# Altium schematic sheet PowerSupply.SchDoc
size A; SheetNumber: 2; SheetTotal: 2
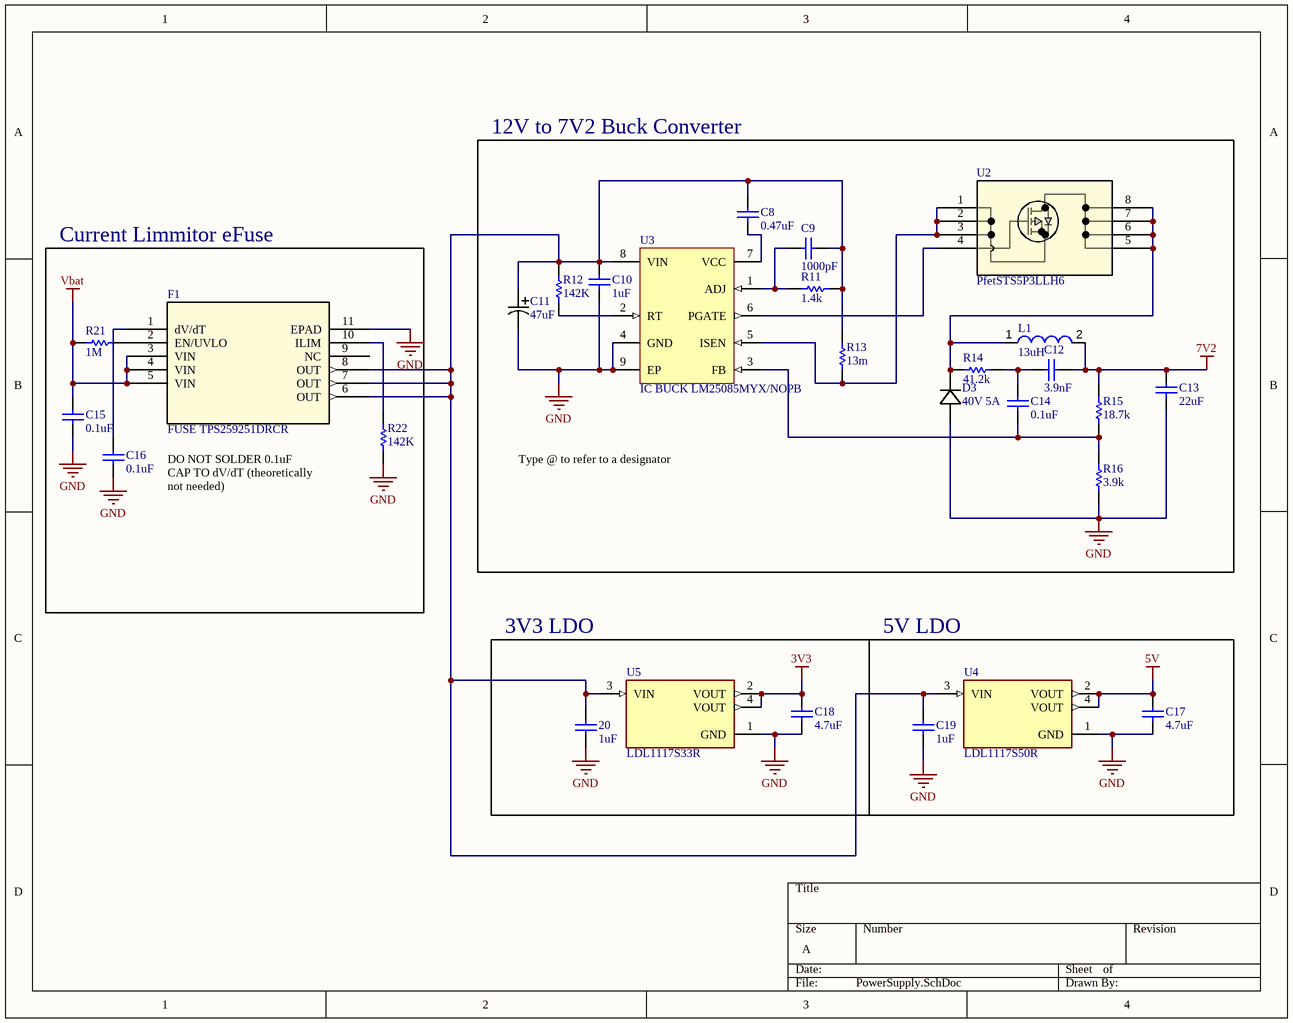
[diagram p0: PowerSupply.SchDoc]

## Parts
20  1uF  [RES 0805]
C8  0.47uF  [RES 0805]
C9  1000pF  [RES 0805]
C10  1uF  [RES 0805]
C11  47uF  [CAP ELC 47uF]
C12  3.9nF  [RES 0805]
C13  22uF  [RES 0805]
C14  0.1uF  [RES 0805]
C15  0.1uF  [RES 0805]
C16  0.1uF  [RES 0805]
C17  4.7uF  [RES 0805]
C18  4.7uF  [RES 0805]
C19  1uF  [RES 0805]
D3  40V 5A  [DIODE SCHOTTKY 40V 5A]
F1  FUSE TPS259251DRCR  [DRC10_1P65X2P40_TEX]
L1  13uH  [IND 13UH 9A 24 MOHM SMD]
R11  1.4k  [RES 0805]
R12  142K  [RES 0805]
R13  13m  [RES 0805]
R14  41.2k  [RES 0805]
R15  18.7k  [RES 0805]
R16  3.9k  [RES 0805]
R21  1M  [RES 0805]
R22  142K  [RES 0805]
U2  PfetSTS5P3LLH6  [STS5P3LLH6]
U3  IC BUCK LM25085MYX/NOPB
U4  LDL1117S50R  [SOT230P700X180-4N]
U5  LDL1117S33R  [SOT230P700X180-4N]

## Blocks framed on the sheet
12V to 7V2 Buck Converter: C8-C14 D3 L1 R11-R16 U2 U3
Current Limmitor eFuse: C15 C16 F1 R21 R22

## Nets
3V3: C18.2 U5.2(VOUT) U5.4(VOUT)
5V: C17.2 U4.2(VOUT) U4.4(VOUT)
7V2: C12.2 C13.2 L1.2 R15.2
GND: 20.1 C10.1 C11.2 C13.1 C15.1 C16.1 C17.1 C18.1 C19.1 D3.2(ANODE) F1.11(EPAD) R16.1 R22.1 U3.4(GND) U3.9(EP) U4.1(GND) U5.1(GND)
Vbat: C15.2 F1.3(VIN) F1.4(VIN) F1.5(VIN) R21.2
Net20_2: 20.2 C8.2 C9.2 C10.2 C11.1 C19.2 F1.6(OUT) F1.7(OUT) F1.8(OUT) R11.2 R12.2 R13.2 U3.8(VIN) U4.3(VIN) U5.3(VIN)
NetC8_1: C8.1 U3.7(VCC)
NetC9_1: C9.1 R11.1 U3.1(ADJ)
NetC12_1: C12.1 C14.2 R14.2
NetC14_1: C14.1 R15.1 R16.2 U3.3(FB)
NetC16_2: C16.2 F1.1(dV/dT)
NetD3_1: D3.1(CATHODE) L1.1 R14.1 U2.5(D) U2.6(D) U2.7(D) U2.8(D)
NetF1_2: F1.2(EN/UVLO) R21.1
NetF1_10: F1.10(ILIM) R22.2
NetR12_1: R12.1 U3.2(RT)
NetR13_1: R13.1 U2.1(S) U2.2(S) U2.3(S) U3.5(ISEN)
NetU2_4: U2.4(G) U3.6(PGATE)

Not connected (* = marked no-connect by the designer): F1 9(NC)

## Notes on the sheet
- DO NOT SOLDER 0.1uF CAP TO dV/dT (theoretically not needed)
- (near D3) Type @ to refer to a designator
- 3V3 LDO
- 5V LDO

## Library data of the parts
20 C10 C19 = CAP CER 1uF 10% 50V 0805: Ceramic Capacitor, Multilayer, Ceramic, 50V, 10% +Tol, 10% -Tol, X7R, 15% TC, 1uF, Surface Mount, 0805; Manufacturer: Samsung; Manufacturer Part Number: CL21B105KBFNNNE; Multilayer: Yes; Supplier: Digikey; Supplier Part Number: 1276-1029-1-ND; RoHS: Yes; Category: Ceramic Capacitors; Stock: 572828; Pricing: 1=0.1, 10=0.051, 100=0.0321, 1000=0.02181 (USD); Mounting Technology: Surface Mount; Pins: 2; Dielectric Material: Ceramic; Package Shape: Rectangular; Case/Package: 0805; Terminal Finish: Nickel; Min Operating Temperature: -55°C; Max Operating Temperature: 125°C; JESD-609 Code: e3; Value: 1uF; Capacitor Type: Ceramic; Tolerance  (fill in as +-): 10%; Package Style: SMTMeter; Packaging: Tape and Reel; Tolerance (fill in as +-): 10%; Rated DC Voltage (URdc): 50V; Temperature Characteristics Code: X7R; Termination: Wraparound; Length: 2mm; Width: 1.25mm; Height: 1.35mm; Reach SVHC Compliant: Yes; RoHS Compliant: Yes; ComponentLink1URL: https://datasheet.ciiva.com:443/pdfs/VipMasterIC/IC/SEMS/SEMS-S-A0008524728/SEMS-S-A0008523023-1.pdf?src-supplier=IHS+Markit; ComponentLink1Description: https://datasheet.ciiva.com:443/pdfs/VipMasterIC/IC/SEMS/SEMS-S-A0008524728/SEMS-S-A0008523023-1.pdf?src-supplier=IHS+Markit; ComponentLink2URL: https://datasheet.ciiva.com/25800/cl21b105kbfnnne-25800291.pdf?src-supplier=Digikey; ComponentLink2Description: https://datasheet.ciiva.com/25800/cl21b105kbfnnne-25800291.pdf?src-supplier=Digikey; ComponentLink3URL: https://datasheet.ciiva.com/16449/cl21b105kbfnnne-16449003.pdf?src-supplier=Future+Electronics; ComponentLink3Description: https://datasheet.ciiva.com/16449/cl21b105kbfnnne-16449003.pdf?src-supplier=Future+Electronics
C8 = CAP CER 0.47uF 10% 50V 0805: Ceramic Capacitor, Multilayer, Ceramic, 50V, 10% +Tol, 10% -Tol, X7R, 15% TC, 0.47uF, Surface Mount, 0805; Manufacturer: Murata; Manufacturer Part Number: GRM21BR71H474KA88L; Value: 470nF; Multilayer: Yes; Supplier: Mouser; Supplier Part Number: 81-GRM21BR71H474KA88; RoHS: Yes; Category: Ceramic Capacitors; Stock: 177825; Pricing: 1=0.19, 10=0.114, 50=0.114, 100=0.08, 1000=0.057, 10000=0.036 (USD); Mounting Technology: Surface Mount; Pins: 2; Dielectric Material: Ceramic; Package Shape: Rectangular; Case/Package: 0805; Terminal Finish: Nickel; Min Operating Temperature: -55°C; Max Operating Temperature: 125°C; JESD-609 Code: e3; Capacitor Type: Ceramic; Tolerance  (fill in as +-): 10%; Package Style: SMTMeter; Packaging: Tape and Reel; Tolerance (fill in as +-): 10%; Rated DC Voltage (URdc): 50V; Temperature Characteristics Code: X7R; Termination: Wraparound; Length: 2mm; Width: 1.25mm; Height: 1.25mm; Reach SVHC Compliant: Yes; RoHS Compliant: Yes; ComponentLink1URL: https://datasheet.ciiva.com:443/pdfs/VipMasterIC/IC/MURE/MURE-S-A0008911154/MURE-S-A0008911261-1.pdf?src-supplier=IHS+Markit; ComponentLink1Description: https://datasheet.ciiva.com:443/pdfs/VipMasterIC/IC/MURE/MURE-S-A0008911154/MURE-S-A0008911261-1.pdf?src-supplier=IHS+Markit; ComponentLink2URL: https://datasheet.ciiva.com/3777/4932grm21br71h474ka8823-3777215.pdf?src-supplier=Arrow+Electronics; ComponentLink2Description: https://datasheet.ciiva.com/3777/4932grm21br71h474ka8823-3777215.pdf?src-supplier=Arrow+Electronics; ComponentLink3URL: https://datasheet.ciiva.com/11789/0900766b80ef921d-11789192.pdf?src-supplier=Rs; ComponentLink3Description: https://datasheet.ciiva.com/11789/0900766b80ef921d-11789192.pdf?src-supplier=Rs; ComponentLink4URL: https://datasheet.ciiva.com/19476/1859010-19476382.pdf?src-supplier=Jameco; ComponentLink4Description: https://datasheet.ciiva.com/19476/1859010-19476382.pdf?src-supplier=Jameco; ComponentLink5URL: https://datasheet.ciiva.com/29200/453181-da-01-en-vs-kondensator-0805-29200574.pdf?src-supplier=Conrad; ComponentLink5Description: https://datasheet.ciiva.com/29200/453181-da-01-en-vs-kondensator-0805-29200574.pdf?src-supplier=Conrad; ComponentLink6URL: https://datasheet.ciiva.com/137/product-137379.pdf?src-supplier=Digikey; ComponentLink6Description: https://datasheet.ciiva.com/137/product-137379.pdf?src-supplier=Digikey; ComponentLink7URL: https://datasheet.ciiva.com/137/product-137380.pdf?src-supplier=Digikey; ComponentLink7Description: https://datasheet.ciiva.com/137/product-137380.pdf?src-supplier=Digikey; ComponentLink8URL: https://datasheet.ciiva.com/137/product-137381.pdf?src-supplier=Digikey; ComponentLink8Description: https://datasheet.ciiva.com/137/product-137381.pdf?src-supplier=Digikey; ComponentLink9URL: https://datasheet.ciiva.com/14116/grm21br71h474ka88l-eng-tds-14116422.pdf?src-supplier=Distrelec; ComponentLink9Description: https://datasheet.ciiva.com/14116/grm21br71h474ka88l-eng-tds-14116422.pdf?src-supplier=Distrelec; ComponentLink10URL: https://datasheet.ciiva.com/16357/product-16357717.pdf?src-supplier=Future+Electronics; ComponentLink10Description: https://datasheet.ciiva.com/16357/product-16357717.pdf?src-supplier=Future+Electronics
C9 = CAP CER 1000pF 10% 50V 0805: Ceramic Capacitor, Multilayer, Ceramic, 50V, 10% +Tol, 10% -Tol, X7R, 15% TC, 0.001uF, Surface Mount, 0805; Manufacturer: KEMET; Manufacturer Part Number: C0805C102K5RACTU; Value: 1nF; Multilayer: Yes; Supplier: Arrow Electronics; Supplier Part Number: C0805C102K5RACTU; RoHS: Yes; Category: Ceramic Capacitors; Stock: 1152000; Pricing: 4000=0.0176, 8000=0.0114 (USD); Mounting Technology: Surface Mount; Pins: 2; Dielectric Material: Ceramic; Package Shape: Rectangular; Case/Package: 0805; Terminal Finish: Nickel; Min Operating Temperature: -55°C; Max Operating Temperature: 125°C; JESD-609 Code: e3; Capacitor Type: Ceramic; Tolerance  (fill in as +-): 10%; Packaging: Tape and Reel; Tolerance (fill in as +-): 10%; Rated DC Voltage (URdc): 50V; Temperature Characteristics Code: X7R; Termination: Wraparound; Reach SVHC Compliant: Yes; RoHS Compliant: Yes; ComponentLink1URL: http://capacitoredge.kemet.com:80/capedge2/intellispec.jsp?pn=C0805C102K5RACTU&displayPN=C0805C102K5RACTU&src-supplier=IHS+Markit; ComponentLink1Description: http://capacitoredge.kemet.com:80/capedge2/intellispec.jsp?pn=C0805C102K5RACTU&displayPN=C0805C102K5RACTU&src-supplier=IHS+Markit; ComponentLink2URL: https://datasheet.ciiva.com/18193/getdatasheetpartid-385640-18193338.pdf?src-supplier=Verical; ComponentLink2Description: https://datasheet.ciiva.com/18193/getdatasheetpartid-385640-18193338.pdf?src-supplier=Verical; ComponentLink3URL: https://datasheet.ciiva.com/7842/1918693-7842527.pdf?src-supplier=Element14; ComponentLink3Description: https://datasheet.ciiva.com/7842/1918693-7842527.pdf?src-supplier=Element14; ComponentLink4URL: https://datasheet.ciiva.com/39122/docfinderpartnumberc0402c102k5ractu-39122922.pdf?src-supplier=Onlinecomponents.com; ComponentLink4Description: https://datasheet.ciiva.com/39122/docfinderpartnumberc0402c102k5ractu-39122922.pdf?src-supplier=Onlinecomponents.com
C11 = CAP ELCALUM 47uF 20% 50V: Aluminum Electrolytic Capacitor, Polarized, Aluminum (wet), 50V, 20% +Tol, 20% -Tol, 47uF, Surface Mount, 2626; Manufacturer: Nichicon; Manufacturer Part Number: UWT1H470MCL1GS; Dielectric Material: Aluminium; Leakage Current: 23.5uA; Ripple Current: 63mA; Tan Delta: 0.14; Supplier: Digikey; Supplier Part Number: 493-2225-1-ND; RoHS: Yes; Category: Aluminum Electrolytic Capacitors; Stock: 52254; Pricing: 1=0.42, 10=0.258, 50=0.1948, 100=0.1747 (USD); Mounting Technology: Surface Mount; Pins: 2; Package Shape: Cylindrical; Case/Package: 2626; Terminal Finish: Tin; Min Operating Temperature: -55°C; Max Operating Temperature: 105°C; JESD-609 Code: e6; Polarity: Polarized; Value: 47uF; Capacitor Type: Aluminium; Tolerance  (fill in as +-): 20%; Package Style: SMTMeter; Packaging: Tape and Reel; Tolerance (fill in as +-): 20%; Rated DC Voltage (URdc): 50V; Termination: One Surface; Length: 7mm; Width: 6.6mm; Height: 7.7mm; Reach SVHC Compliant: No; RoHS Compliant: Yes; ComponentLink1URL: https://datasheet.ciiva.com:443/pdfs/VipMasterIC/IC/NICH/NICH-S-A0009252174/NICH-S-A0009252174-1.pdf?src-supplier=IHS+Markit; ComponentLink1Description: https://datasheet.ciiva.com:443/pdfs/VipMasterIC/IC/NICH/NICH-S-A0009252174/NICH-S-A0009252174-1.pdf?src-supplier=IHS+Markit; ComponentLink2URL: https://datasheet.ciiva.com/11777/0900766b80649b51-11777944.pdf?src-supplier=Rs; ComponentLink2Description: https://datasheet.ciiva.com/11777/0900766b80649b51-11777944.pdf?src-supplier=Rs; ComponentLink3URL: https://datasheet.ciiva.com/30522/getdatasheetpartid-450029-30522236.pdf?src-supplier=Verical; ComponentLink3Description: https://datasheet.ciiva.com/30522/getdatasheetpartid-450029-30522236.pdf?src-supplier=Verical; ComponentLink4URL: https://datasheet.ciiva.com/96/e-wt-96728.pdf?src-supplier=Digikey; ComponentLink4Description: https://datasheet.ciiva.com/96/e-wt-96728.pdf?src-supplier=Digikey; ComponentLink5URL: https://datasheet.ciiva.com/96/e-wt-96729.pdf?src-supplier=Digikey; ComponentLink5Description: https://datasheet.ciiva.com/96/e-wt-96729.pdf?src-supplier=Digikey; ComponentLink6URL: https://datasheet.ciiva.com/96/e-wt-96730.pdf?src-supplier=Digikey; ComponentLink6Description: https://datasheet.ciiva.com/96/e-wt-96730.pdf?src-supplier=Digikey; ComponentLink7URL: https://datasheet.ciiva.com/11687/e-wt-11687610.pdf?src-supplier=Avnet; ComponentLink7Description: https://datasheet.ciiva.com/11687/e-wt-11687610.pdf?src-supplier=Avnet; ComponentLink8URL: https://datasheet.ciiva.com/16512/e-wt-16512663.pdf?src-supplier=Future+Electronics; ComponentLink8Description: https://datasheet.ciiva.com/16512/e-wt-16512663.pdf?src-supplier=Future+Electronics
C12 = CAP CER 3.9nF 10% 50V 0805: Ceramic Capacitor, Multilayer, Ceramic, 50V, 10% +Tol, 10% -Tol, X7R, 15% TC, 0.0039uF, Surface Mount, 0805; Manufacturer: Yageo; Manufacturer Part Number: CC0805KRX7R9BB392; Multilayer: Yes; Supplier: Digikey; Supplier Part Number: 311-1132-1-ND; RoHS: Yes; Category: Ceramic Capacitors; Stock: 12532; Pricing: 1=0.1, 10=0.058, 100=0.0361, 1000=0.02472 (USD); Mounting Technology: Surface Mount; Pins: 2; Dielectric Material: Ceramic; Package Shape: Rectangular; Case/Package: 0805; Terminal Finish: Nickel; Min Operating Temperature: -55°C; Max Operating Temperature: 125°C; JESD-609 Code: e3; Value: 3.9nF; Capacitor Type: Ceramic; Tolerance  (fill in as +-): 10%; Package Style: SMTMeter; Packaging: Tape and Reel; Tolerance (fill in as +-): 10%; Rated DC Voltage (URdc): 50V; Temperature Characteristics Code: X7R; Termination: Wraparound; Length: 2mm; Width: 1.25mm; Height: 0.6mm; Reach SVHC Compliant: Yes; RoHS Compliant: Yes; ComponentLink1URL: https://datasheet.ciiva.com:443/pdfs/VipMasterIC/IC/YAGO/YAGOS02868/YAGOS02868-1.pdf?src-supplier=IHS+Markit; ComponentLink1Description: https://datasheet.ciiva.com:443/pdfs/VipMasterIC/IC/YAGO/YAGOS02868/YAGOS02868-1.pdf?src-supplier=IHS+Markit; ComponentLink2URL: https://datasheet.ciiva.com/144/mlccorderingcode-144622.pdf?src-supplier=Digikey; ComponentLink2Description: https://datasheet.ciiva.com/144/mlccorderingcode-144622.pdf?src-supplier=Digikey; ComponentLink3URL: https://datasheet.ciiva.com/144/mlccorderingcode-144623.pdf?src-supplier=Digikey; ComponentLink3Description: https://datasheet.ciiva.com/144/mlccorderingcode-144623.pdf?src-supplier=Digikey; ComponentLink4URL: https://datasheet.ciiva.com/29148/445107-da-01-en-kerko-chip-0805-x7r-3900pf-10proz-50vg-29148917.pdf?src-supplier=Conrad; ComponentLink4Description: https://datasheet.ciiva.com/29148/445107-da-01-en-kerko-chip-0805-x7r-3900pf-10proz-50vg-29148917.pdf?src-supplier=Conrad; ComponentLink5URL: https://datasheet.ciiva.com/11465/upy-gphc-x7r-6-3v-to-50v-8-11465741.pdf?src-supplier=Avnet; ComponentLink5Description: https://datasheet.ciiva.com/11465/upy-gphc-x7r-6-3v-to-50v-8-11465741.pdf?src-supplier=Avnet; ComponentLink6URL: https://datasheet.ciiva.com/144/mlccorderingcode-144624.pdf?src-supplier=Digikey; ComponentLink6Description: https://datasheet.ciiva.com/144/mlccorderingcode-144624.pdf?src-supplier=Digikey
C13 = CAP CER 22uF 20% 25V 0805: Ceramic Capacitor, Multilayer, Ceramic, 25V, 20% +Tol, 20% -Tol, X5R, 15% TC, 22uF, Surface Mount, 0805; Manufacturer: Samsung; Manufacturer Part Number: CL21A226MAYNNNE; Multilayer: Yes; Supplier: Digikey; Supplier Part Number: 1276-CL21A226MAYNNNECT-ND; RoHS: Yes; Category: Ceramic Capacitors; Stock: 495548; Pricing: 1=0.22, 10=0.13, 100=0.085, 1000=0.06041 (USD); Mounting Technology: Surface Mount; Pins: 2; Dielectric Material: Ceramic; Package Shape: Rectangular; Case/Package: 0805; Min Operating Temperature: -55°C; Max Operating Temperature: 85°C; Value: 22uF; Capacitor Type: Ceramic; Tolerance  (fill in as +-): 20%; Packaging: Tape and Reel; Tolerance (fill in as +-): 20%; Rated DC Voltage (URdc): 25V; Temperature Characteristics Code: X5R; Termination: Wraparound; Reach SVHC Compliant: Yes; RoHS Compliant: Yes; ComponentLink1URL: https://datasheet.ciiva.com:443/pdfs/VipMasterIC/IC/SEMS/SEMS-S-A0008528919/SEMS-S-A0008528829-1.pdf?src-supplier=IHS+Markit; ComponentLink1Description: https://datasheet.ciiva.com:443/pdfs/VipMasterIC/IC/SEMS/SEMS-S-A0008528919/SEMS-S-A0008528829-1.pdf?src-supplier=IHS+Markit; ComponentLink2URL: https://datasheet.octopart.com/CL21A226MAYNNNE-Samsung-Electro-Mechanics-datasheet-149154243.pdf?src-supplier=Future+Electronics; ComponentLink2Description: https://datasheet.octopart.com/CL21A226MAYNNNE-Samsung-Electro-Mechanics-datasheet-149154243.pdf?src-supplier=Future+Electronics; ComponentLink3URL: https://datasheet.octopart.com/CL21A226MAYNNNE-Samsung-datasheet-8326407.pdf?src-supplier=TME; ComponentLink3Description: https://datasheet.octopart.com/CL21A226MAYNNNE-Samsung-datasheet-8326407.pdf?src-supplier=TME
C14-C16 = CAP CER 0.1uF 10% 50V 0805: Ceramic Capacitor, Multilayer, Ceramic, 50V, 10% +Tol, 10% -Tol, X7R, 15% TC, 0.1uF, Surface Mount, 0805; Manufacturer: Yageo; Manufacturer Part Number: CC0805KRX7R9BB104; Value: 100nF; Multilayer: Yes; Supplier: Digikey; Supplier Part Number: 311-1140-1-ND; RoHS: Yes; Category: Ceramic Capacitors; Stock: 3691132; Pricing: 1=0.08, 10=0.021, 100=0.0152, 1000=0.0144, 4000=0.0112, 8000=0.0104, 12000=0.01, 20000=0.00985 (USD); Mounting Technology: Surface Mount; Pins: 2; Dielectric Material: Ceramic; Package Shape: Rectangular; Case/Package: 0805; Terminal Finish: Nickel; Min Operating Temperature: -55°C; Max Operating Temperature: 125°C; JESD-609 Code: e3; Capacitor Type: Ceramic; Tolerance  (fill in as +-): 10%; Package Style: SMTMeter; Packaging: Tape and Reel; Tolerance (fill in as +-): 10%; Rated DC Voltage (URdc): 50V; Temperature Characteristics Code: X7R; Termination: Wraparound; Length: 2mm; Width: 1.25mm; Height: 0.85mm; Reach SVHC Compliant: Yes; RoHS Compliant: Yes; ComponentLink1URL: https://datasheet.ciiva.com:443/pdfs/VipMasterIC/IC/YAGO/YAGO-S-A0003557223/YAGO-S-A0003557223-1.pdf?src-supplier=IHS+Markit; ComponentLink1Description: https://datasheet.ciiva.com:443/pdfs/VipMasterIC/IC/YAGO/YAGO-S-A0003557223/YAGO-S-A0003557223-1.pdf?src-supplier=IHS+Markit; ComponentLink2URL: https://datasheet.ciiva.com/11786/0900766b80d84f1d-11786009.pdf?src-supplier=Rs; ComponentLink2Description: https://datasheet.ciiva.com/11786/0900766b80d84f1d-11786009.pdf?src-supplier=Rs; ComponentLink3URL: https://datasheet.ciiva.com/155/mlccorderingcode-155929.pdf?src-supplier=Digikey; ComponentLink3Description: https://datasheet.ciiva.com/155/mlccorderingcode-155929.pdf?src-supplier=Digikey; ComponentLink4URL: https://datasheet.ciiva.com/155/mlccorderingcode-155930.pdf?src-supplier=Digikey; ComponentLink4Description: https://datasheet.ciiva.com/155/mlccorderingcode-155930.pdf?src-supplier=Digikey; ComponentLink5URL: https://datasheet.ciiva.com/155/mlccorderingcode-155931.pdf?src-supplier=Digikey; ComponentLink5Description: https://datasheet.ciiva.com/155/mlccorderingcode-155931.pdf?src-supplier=Digikey; ComponentLink6URL: https://datasheet.ciiva.com/46393/1734573-46393307.pdf?src-supplier=Element14; ComponentLink6Description: https://datasheet.ciiva.com/46393/1734573-46393307.pdf?src-supplier=Element14; ComponentLink7URL: https://datasheet.ciiva.com/28450/1489800-28450805.pdf?src-supplier=Element14; ComponentLink7Description: https://datasheet.ciiva.com/28450/1489800-28450805.pdf?src-supplier=Element14; ComponentLink8URL: https://datasheet.ciiva.com/11464/upy-gphc-x7r-6-3v-to-50v-8-11464757.pdf?src-supplier=Avnet; ComponentLink8Description: https://datasheet.ciiva.com/11464/upy-gphc-x7r-6-3v-to-50v-8-11464757.pdf?src-supplier=Avnet; ComponentLink9URL: https://datasheet.ciiva.com/29242/445210-da-01-en-kerko-chip-0805-x7r-0-1uf-10proz-50vg-29242074.pdf?src-supplier=Conrad; ComponentLink9Description: https://datasheet.ciiva.com/29242/445210-da-01-en-kerko-chip-0805-x7r-0-1uf-10proz-50vg-29242074.pdf?src-supplier=Conrad
C17 C18 = CAP CER 4.7uF 10% 25V 0805: Ceramic Capacitor, Multilayer, Ceramic, 25V, 10% +Tol, 10% -Tol, X5R, 15% TC, 4.7uF, Surface Mount, 0805; Manufacturer: Samsung; Manufacturer Part Number: CL21A475KAQNNNE; Multilayer: Yes; ComponentLink1Description: https://www.digikey.ca/en/products/detail/samsung-electro-mechanics/CL21A475KAQNNNE/3886902; ComponentLink1URL: *; Supplier: Digikey; Supplier Part Number: 1276-1244-1-ND; RoHS: Yes; Category: Ceramic Capacitors; Stock: 2691488; Pricing: 1=0.1, 10=0.048, 100=0.03, 1000=0.02035 (USD); Mounting Technology: Surface Mount; Pins: 2; Dielectric Material: Ceramic; Package Shape: Rectangular; Case/Package: 0805; Terminal Finish: Nickel; Min Operating Temperature: -55°C; Max Operating Temperature: 85°C; JESD-609 Code: e3; Value: 4.7uF; Capacitor Type: Ceramic; Tolerance  (fill in as +-): 10%; Package Style: SMTMeter; Packaging: Tape and Reel; Tolerance (fill in as +-): 10%; Rated DC Voltage (URdc): 25V; Temperature Characteristics Code: X5R; Termination: Wraparound; Length: 2mm; Width: 1.25mm; Height: 1.4mm; Reach SVHC Compliant: Yes; RoHS Compliant: Yes; ComponentLink2URL: https://datasheet.ciiva.com:443/pdfs/VipMasterIC/IC/SEMS/SEMS-S-A0008528919/SEMS-S-A0008528938-1.pdf?src-supplier=IHS+Markit; ComponentLink2Description: https://datasheet.ciiva.com:443/pdfs/VipMasterIC/IC/SEMS/SEMS-S-A0008528919/SEMS-S-A0008528938-1.pdf?src-supplier=IHS+Markit; ComponentLink3URL: https://datasheet.ciiva.com/25798/cl21a475kaqnnne-25798882.pdf?src-supplier=Digikey; ComponentLink3Description: https://datasheet.ciiva.com/25798/cl21a475kaqnnne-25798882.pdf?src-supplier=Digikey
D3 = DIODE SCHOTTKY 40V 5A: Rectifier Diode, Schottky, 1 Phase, 1 Element, 5A, 40V V(RRM), Silicon, DO-214AC; Manufacturer: MCC; Manufacturer Part Number: SK54A-LTP; Package Body Material: Plastic; Application(s): GENERAL PURPOSE; Forward Voltage: 550mV; Non-rep Pk Forward Current-Max: 100A; Number of Elements: 1; Max Reverse Current: 1mA; Time @ Peak Reflow Temperature-Max (s): 10s; Supplier: Digikey; Supplier Part Number: SK54A-LTPMSCT-ND; RoHS: Yes; Category: Rectifier Diodes; Stock: 28291; Pricing: 1=0.33, 10=0.243, 100=0.1933, 500=0.14502, 1000=0.10466, 2000=0.10359 (USD); Pins: 2; Diode Element Material: SILICON; Package Shape: Rectangular; Min Operating Temperature: -55°C; Max Operating Temperature: 150°C; Diode Type: RECTIFIER; JESD-30 Code: R-PDSO-C2; Moisture Sensitivity Level: 1; Number of Phases: 1; Max Output current: 5A; Package Style: SMALL OUTLINEMeter; Peak Reflow Temperature (Cel): 260°C; Rep Pk Reverse Voltage-Max: 40V; Surface Mount: Yes; Technology: SCHOTTKY; Terminal Form: C BEND; Terminal Position: DUAL; JEDEC-95 Code: DO-214AC; Reach SVHC Compliant: No; RoHS Compliant: Yes; ComponentLink1URL: https://datasheet.ciiva.com:443/pdfs/VipMasterIC/IC/MCCC/MCCC-S-A0009699019/MCCC-S-A0009699019-1.pdf?src-supplier=IHS+Markit; ComponentLink1Description: https://datasheet.ciiva.com:443/pdfs/VipMasterIC/IC/MCCC/MCCC-S-A0009699019/MCCC-S-A0009699019-1.pdf?src-supplier=IHS+Markit; ComponentLink2URL: http://www.mccsemi.com/up_pdf/SK52A-L-SK510A-L(DO-214AC).pdf?src-supplier=Digikey; ComponentLink2Description: http://www.mccsemi.com/up_pdf/SK52A-L-SK510A-L(DO-214AC).pdf?src-supplier=Digikey; ComponentLink3URL: https://datasheet.octopart.com/SK54A-LTP-Micro-Commercial-datasheet-137977739.pdf?src-supplier=Future+Electronics; ComponentLink3Description: https://datasheet.octopart.com/SK54A-LTP-Micro-Commercial-datasheet-137977739.pdf?src-supplier=Future+Electronics
F1 = FUSE TPS259251DRCR: Power Supply Support Circuit, Adjustable, 1 Channel, PDSO10; Manufacturer: Texas Instruments; Package Body Material: Plastic; Adjustable Threshold: Yes; Number of Channels: 1; Max Supply Voltage: 5.5V; Min Supply Voltage: 4.5V; Nominal Supply Voltage: 5V; Supplier: Digikey; Supplier Part Number: 296-47233-1-ND; Manufacturer Part Number: TPS259251DRCR; RoHS: Yes; Category: Integrated Circuits (ICs); Stock: 4315; Pricing: 1=1.39, 10=1.09, 100=0.767, 500=0.624, 1000=0.577 (USD); Case/Package: HVSON; Pins: 10; Package Shape: Square; Terminal Finish: Nickel; Min Operating Temperature: -40°C; Max Operating Temperature: 85°C; JESD-609 Code: e4; Throw Configuration: POWER SUPPLY SUPPORT CIRCUIT; JESD-30 Code: S-PDSO-N10; Moisture Sensitivity Level: 2; Channels: 1; Package Style: SMALL OUTLINE, HEAT SINK/SLUG, VERY THIN PROFILEMeter; Surface Mount: Yes; Terminal Form: No Lead; Terminal Position: DUAL; Length: 3mm; Width: 3mm; Height - Seated (Max): 1mm; Terminal Pitch: 0.5mm; Temperature Grade: INDUSTRIAL; Reach SVHC Compliant: Yes; RoHS Compliant: Yes; ComponentLink1URL: https://www.ti.com:443/lit/ds/symlink/tps25925.pdf?src-supplier=IHS+Markit; ComponentLink1Description: https://www.ti.com:443/lit/ds/symlink/tps25925.pdf?src-supplier=IHS+Markit; ComponentLink2URL: http://www.ti.com/lit/ds/symlink/tps25925.pdf?src-supplier=Digikey; ComponentLink2Description: http://www.ti.com/lit/ds/symlink/tps25925.pdf?src-supplier=Digikey; ComponentLink3URL: http://www.ti.com/general/docs/suppproductinfo.tsp?distId=10&amp;gotoUrl=http%3A%2F%2Fwww.ti.com%2Flit%2Fgpn%2Ftps25925&src-supplier=Digikey; ComponentLink3Description: http://www.ti.com/general/docs/suppproductinfo.tsp?distId=10&amp;gotoUrl=http%3A%2F%2Fwww.ti.com%2Flit%2Fgpn%2Ftps25925&src-supplier=Digikey; ComponentLink4URL: http://www.ti.com/general/docs/lit/getliterature.tsp?genericPartNumber=TPS25925&&fileType=pdf&src-supplier=Avnet; ComponentLink4Description: http://www.ti.com/general/docs/lit/getliterature.tsp?genericPartNumber=TPS25925&&fileType=pdf&src-supplier=Avnet; ComponentLink5URL: http://www.ti.com/lit/gpn/tps25925?src-supplier=Mouser; ComponentLink5Description: http://www.ti.com/lit/gpn/tps25925?src-supplier=Mouser
L1 = IND 13uH 9A: General Purpose Inductor, 13uH, 20%, 1 Element, SMD, 5550; Manufacturer: Pulse; Manufacturer Part Number: PA4343.133NLT; Supplier: Digikey; Supplier Part Number: 553-3445-1-ND; RoHS: Yes; Category: Fixed Inductors; Stock: 3011; Pricing: 1=1.77, 10=1.377, 25=1.2456, 50=1.1542, 100=1.0692, 250=0.96604 (USD); Inductor Type: GENERAL PURPOSE INDUCTOR; Reach SVHC Compliant: Yes; RoHS Compliant: Yes; ComponentLink1URL: https://datasheet.ciiva.com:443/pdfs/VipMasterIC/IC/PLEI/PLEI-S-A0006344815/PLEI-S-A0006344815-1.pdf?src-supplier=IHS+Markit; ComponentLink1Description: https://datasheet.ciiva.com:443/pdfs/VipMasterIC/IC/PLEI/PLEI-S-A0006344815/PLEI-S-A0006344815-1.pdf?src-supplier=IHS+Markit; ComponentLink2URL: https://datasheet.octopart.com/PA4343.133NLT-Pulse-datasheet-137333301.pdf?src-supplier=Sager+Electronics; ComponentLink2Description: https://datasheet.octopart.com/PA4343.133NLT-Pulse-datasheet-137333301.pdf?src-supplier=Sager+Electronics; ComponentLink3URL: https://datasheet.octopart.com/PA4343.133NLT-Pulse-datasheet-165531498.pdf?src-supplier=Master+Electronics; ComponentLink3Description: https://datasheet.octopart.com/PA4343.133NLT-Pulse-datasheet-165531498.pdf?src-supplier=Master+Electronics
R11 = RES 1.4k 1% 0.125W 0805: Fixed Resistor, Metal Glaze/thick Film, 0.125W, 1400ohm, 150V, 1% +/-Tol, 100ppm/Cel, Surface Mount, 0805; Manufacturer: Yageo; Manufacturer Part Number: RC0805FR-071K4L; Additional Feature: LASER TRIMMABLE; Power: 125mW; Rated Temperature: 70°C; Value: 1.4kR; Temperature Coefficient (ppm/Cel): 100; Package Height: 0.5mm; Package Length: 2mm; Package Width: 1.25mm; Supplier: Future Electronics; Supplier Part Number: 5205166; RoHS: Yes; Category: Chip SMD Resistors; Stock: 70000; Pricing: 5000=0.0021, 20000=0.002, 100000=0.0019, 200000=0.0018, 625000=0.0017 (USD); Mounting Technology: Surface Mount; Pins: 2; Package Shape: Rectangular; Case/Package: 0805; Terminal Finish: Nickel; Min Operating Temperature: -55°C; Max Operating Temperature: 155°C; Tolerance: 1%; JESD-609 Code: e3; Resistor Type: FIXED RESISTOR; Construction: Chip; Packaging: Tape and Reel; Technology: METAL GLAZE/THICK FILM; Termination: Wraparound; Working Voltage: 150V; Reach SVHC Compliant: Yes; RoHS Compliant: Yes; ComponentLink1URL: https://datasheet.ciiva.com:443/pdfs/VipMasterIC/IC/YAGO/YAGO-S-A0008145938/YAGO-S-A0008145938-1.pdf?src-supplier=IHS+Markit; ComponentLink1Description: https://datasheet.ciiva.com:443/pdfs/VipMasterIC/IC/YAGO/YAGO-S-A0008145938/YAGO-S-A0008145938-1.pdf?src-supplier=IHS+Markit; ComponentLink2URL: https://datasheet.ciiva.com/2519/pyu-r-int-thick-7-2519780.pdf?src-supplier=Digikey; ComponentLink2Description: https://datasheet.ciiva.com/2519/pyu-r-int-thick-7-2519780.pdf?src-supplier=Digikey; ComponentLink3URL: https://datasheet.ciiva.com/2519/pyu-r-int-thick-7-2519781.pdf?src-supplier=Digikey; ComponentLink3Description: https://datasheet.ciiva.com/2519/pyu-r-int-thick-7-2519781.pdf?src-supplier=Digikey; ComponentLink4URL: https://datasheet.ciiva.com/2519/pyu-r-int-thick-7-2519782.pdf?src-supplier=Digikey; ComponentLink4Description: https://datasheet.ciiva.com/2519/pyu-r-int-thick-7-2519782.pdf?src-supplier=Digikey; ComponentLink5URL: https://datasheet.ciiva.com/5596/rc0805-5596057.pdf?src-supplier=Mouser; ComponentLink5Description: https://datasheet.ciiva.com/5596/rc0805-5596057.pdf?src-supplier=Mouser; ComponentLink6URL: https://datasheet.ciiva.com/17033/rc0805-17033654.pdf?src-supplier=Future+Electronics; ComponentLink6Description: https://datasheet.ciiva.com/17033/rc0805-17033654.pdf?src-supplier=Future+Electronics
R12 R22 = RES 142K 0.1% 1/8W 0805: Fixed Resistor, Thin Film, 0.125W, 142000ohm, 150V, 0.1% +/-Tol, 25ppm/Cel, Surface Mount, 0805; Manufacturer: Yageo; Manufacturer Part Number: RT0805BRD07142KL; Manufacturer Series: RT; Power: 125mW; Rated Temperature: 70°C; Value: 142kR; Temperature Coefficient (ppm/Cel): 25; Package Height: 0.5mm; Package Length: 2mm; Package Width: 1.25mm; Supplier: Digikey; Supplier Part Number: 13-RT0805BRD07142KLCT-ND; RoHS: Yes; Category: Chip SMD Resistors; Stock: 9837; Pricing: 1=0.17, 10=0.122, 50=0.0958, 100=0.086, 500=0.06622, 1000=0.05881 (USD); Mounting Technology: Surface Mount; Pins: 2; Package Shape: Rectangular; Case/Package: 0805; Terminal Finish: Nickel; Min Operating Temperature: -55°C; Max Operating Temperature: 155°C; Tolerance: 0.1%; JESD-609 Code: e3; Resistor Type: FIXED RESISTOR; Construction: Chip; Packaging: Tape and Reel; Series: RT; Technology: THIN FILM; Termination: Wraparound; Working Voltage: 150V; Reach SVHC Compliant: Yes; RoHS Compliant: Yes; ComponentLink1URL: https://datasheet.ciiva.com:443/pdfs/VipMasterIC/IC/YAGO/YAGOS01974/YAGOS01974-1.pdf?src-supplier=IHS+Markit; ComponentLink1Description: https://datasheet.ciiva.com:443/pdfs/VipMasterIC/IC/YAGO/YAGOS01974/YAGOS01974-1.pdf?src-supplier=IHS+Markit; ComponentLink2URL: https://www.yageo.com/upload/media/product/productsearch/datasheet/rchip/PYu-RT_1-to-0.01_RoHS_L_12.pdf?src-supplier=Digikey; ComponentLink2Description: https://www.yageo.com/upload/media/product/productsearch/datasheet/rchip/PYu-RT_1-to-0.01_RoHS_L_12.pdf?src-supplier=Digikey
R13 = RES 13m 0.5% 0.5W 0805: Resistor Thick Film 0.013Ohm 0.5% 0.5W 2-Pin 0805 T/R; Manufacturer: Panasonic; Manufacturer Part Number: ERJ-6CWDR013V; Supplier: Mouser; Supplier Part Number: 667-ERJ-6CWDR013V; RoHS: No; Category: Chip SMD Resistors; Stock: 7014; Pricing: 1=0.6, 10=0.275, 50=0.275, 100=0.219, 1000=0.149, 10000=0.128 (USD); ComponentLink1URL: https://industrial.panasonic.com/cdbs/www-data/pdf/RDN0000/AOA0000C313.pdf?src-supplier=Digikey; ComponentLink1Description: https://industrial.panasonic.com/cdbs/www-data/pdf/RDN0000/AOA0000C313.pdf?src-supplier=Digikey; ComponentLink2URL: https://datasheet.octopart.com/ERJ-6CWDR013V-Panasonic-datasheet-136473239.pdf?src-supplier=Electro+Sonic; ComponentLink2Description: https://datasheet.octopart.com/ERJ-6CWDR013V-Panasonic-datasheet-136473239.pdf?src-supplier=Electro+Sonic
R14 = RES 41.2K 1% 0.125W 0805: Fixed Resistor, Metal Glaze/thick Film, 0.125W, 41200ohm, 150V, 1% +/-Tol, 100ppm/Cel, Surface Mount, 0805; Manufacturer: Vishay; Manufacturer Part Number: CRCW080541K2FKEA; Power: 125mW; Value: 41.2kR; Temperature Coefficient (ppm/Cel): 100; Rated Temperature: 70°C; Package Height: 0.45mm; Package Length: 2mm; Package Width: 1.25mm; Reference Standard: AEC-Q200; Supplier: Arrow Electronics; Supplier Part Number: CRCW080541K2FKEA; RoHS: Yes; Category: Chip SMD Resistors; Stock: 1; Pricing: 1=0.0041 (USD); Mounting Technology: Surface Mount; Pins: 2; Case/Package: 0805; Terminal Finish: Nickel; Package Shape: Rectangular; Min Operating Temperature: -55°C; Max Operating Temperature: 155°C; Tolerance: 1%; JESD-609 Code: e3; Resistor Type: FIXED RESISTOR; Construction: Chip; Packaging: Tape and Reel; Technology: METAL GLAZE/THICK FILM; Working Voltage: 150V; Termination: Wraparound; Reach SVHC Compliant: Yes; RoHS Compliant: Yes; ComponentLink1URL: https://datasheet.ciiva.com:443/pdfs/VipMasterIC/IC/VISH/VISH-S-A0007266705/VISH-S-A0007266705-1.pdf?src-supplier=IHS+Markit; ComponentLink1Description: https://datasheet.ciiva.com:443/pdfs/VipMasterIC/IC/VISH/VISH-S-A0007266705/VISH-S-A0007266705-1.pdf?src-supplier=IHS+Markit; ComponentLink2URL: https://datasheet.ciiva.com/2467/dcrcwe3-2467875.pdf?src-supplier=Digikey; ComponentLink2Description: https://datasheet.ciiva.com/2467/dcrcwe3-2467875.pdf?src-supplier=Digikey; ComponentLink3URL: https://datasheet.ciiva.com/2467/dcrcwe3-2467876.pdf?src-supplier=Digikey; ComponentLink3Description: https://datasheet.ciiva.com/2467/dcrcwe3-2467876.pdf?src-supplier=Digikey; ComponentLink4URL: https://datasheet.ciiva.com/2467/dcrcwe3-2467877.pdf?src-supplier=Digikey; ComponentLink4Description: https://datasheet.ciiva.com/2467/dcrcwe3-2467877.pdf?src-supplier=Digikey; ComponentLink5URL: https://datasheet.ciiva.com/9009/dcrcwe3-9009672.pdf?src-supplier=Avnet; ComponentLink5Description: https://datasheet.ciiva.com/9009/dcrcwe3-9009672.pdf?src-supplier=Avnet; ComponentLink6URL: https://datasheet.ciiva.com/5552/dcrcwe3-109170-5552669.pdf?src-supplier=Mouser; ComponentLink6Description: https://datasheet.ciiva.com/5552/dcrcwe3-109170-5552669.pdf?src-supplier=Mouser; ComponentLink7URL: https://datasheet.ciiva.com/7671/1697337-7671701.pdf?src-supplier=Element14; ComponentLink7Description: https://datasheet.ciiva.com/7671/1697337-7671701.pdf?src-supplier=Element14; ComponentLink8URL: https://datasheet.ciiva.com/7725/125364-7725967.pdf?src-supplier=Element14; ComponentLink8Description: https://datasheet.ciiva.com/7725/125364-7725967.pdf?src-supplier=Element14; ComponentLink9URL: https://datasheet.ciiva.com/22702/1697337-22702910.pdf?src-supplier=Element14; ComponentLink9Description: https://datasheet.ciiva.com/22702/1697337-22702910.pdf?src-supplier=Element14; ComponentLink10URL: https://datasheet.ciiva.com/16200/dcrcwe3-16200485.pdf?src-supplier=Future+Electronics; ComponentLink10Description: https://datasheet.ciiva.com/16200/dcrcwe3-16200485.pdf?src-supplier=Future+Electronics
R15 = RES 18.7k 1% 0.125W 0805: Fixed Resistor, Metal Glaze/thick Film, 0.125W, 18700ohm, 150V, 1% +/-Tol, 100ppm/Cel, Surface Mount, 0805; Manufacturer: Stackpole Electronics; Manufacturer Part Number: RMCF0805FT18K7; Power: 125mW; Rated Temperature: 70°C; Value: 18.7kR; Temperature Coefficient (ppm/Cel): 100; Package Height: 0.5mm; Package Length: 2mm; Package Width: 1.25mm; Reference Standard: AEC-Q200; Supplier: Digikey; Supplier Part Number: RMCF0805FT18K7CT-ND; RoHS: Yes; Category: Chip SMD Resistors; Stock: 214137; Pricing: 1=0.1, 10=0.025, 100=0.012, 1000=0.00628, 2500=0.00538 (USD); Mounting Technology: Surface Mount; Pins: 2; Package Shape: Rectangular; Case/Package: 0805; Terminal Finish: Nickel; Min Operating Temperature: -55°C; Max Operating Temperature: 155°C; Tolerance: 1%; JESD-609 Code: e3; Resistor Type: FIXED RESISTOR; Construction: Rectangular; Packaging: Tape and Reel; Technology: METAL GLAZE/THICK FILM; Termination: Wraparound; Working Voltage: 150V; Reach SVHC Compliant: Yes; RoHS Compliant: Yes; ComponentLink1URL: https://datasheet.ciiva.com:443/pdfs/VipMasterIC/IC/SEIE/SEIE-S-A0009541969/SEIE-S-A0009541969-1.pdf?src-supplier=IHS+Markit; ComponentLink1Description: https://datasheet.ciiva.com:443/pdfs/VipMasterIC/IC/SEIE/SEIE-S-A0009541969/SEIE-S-A0009541969-1.pdf?src-supplier=IHS+Markit; ComponentLink2URL: http://components.arrow.com/part/dataview/50586056S357577N1174?src-supplier=Arrow+Electronics; ComponentLink2Description: http://components.arrow.com/part/dataview/50586056S357577N1174?src-supplier=Arrow+Electronics; ComponentLink3URL: https://www.seielect.com/catalog/sei-rmcf_rmcp.pdf?src-supplier=Digikey; ComponentLink3Description: https://www.seielect.com/catalog/sei-rmcf_rmcp.pdf?src-supplier=Digikey; ComponentLink4URL: https://www.seielect.com/catalog/SEI-RMCF_RMCP.pdf?src-supplier=Avnet; ComponentLink4Description: https://www.seielect.com/catalog/SEI-RMCF_RMCP.pdf?src-supplier=Avnet; ComponentLink5URL: https://datasheet.octopart.com/RMCF0805FT18K7-Stackpole-Electronics-datasheet-28504820.pdf?src-supplier=Future+Electronics; ComponentLink5Description: https://datasheet.octopart.com/RMCF0805FT18K7-Stackpole-Electronics-datasheet-28504820.pdf?src-supplier=Future+Electronics
R16 = RES 3.9k 1% 0.125W 0805: Fixed Resistor, Metal Glaze/thick Film, 0.125W, 3920ohm, 150V, 1% +/-Tol, 100ppm/Cel, Surface Mount, 0805; Manufacturer: Stackpole Electronics; Manufacturer Part Number: RMCF0805FT3K92; Power: 125mW; Rated Temperature: 70°C; Value: 3.92kR; Temperature Coefficient (ppm/Cel): 100; Package Height: 0.5mm; Package Length: 2mm; Package Width: 1.25mm; Reference Standard: AEC-Q200; Supplier: Digikey; Supplier Part Number: RMCF0805FT3K92CT-ND; RoHS: Yes; Category: Chip SMD Resistors; Stock: 141516; Pricing: 1=0.1, 10=0.021, 50=0.0128, 100=0.0105, 500=0.00704, 1000=0.00602 (USD); Mounting Technology: Surface Mount; Pins: 2; Package Shape: Rectangular; Case/Package: 0805; Terminal Finish: Nickel; Min Operating Temperature: -55°C; Max Operating Temperature: 155°C; Tolerance: 1%; JESD-609 Code: e3; Resistor Type: FIXED RESISTOR; Construction: Rectangular; Packaging: Tape and Reel; Technology: METAL GLAZE/THICK FILM; Termination: Wraparound; Working Voltage: 150V; Reach SVHC Compliant: Yes; RoHS Compliant: Yes; ComponentLink1URL: https://datasheet.ciiva.com:443/pdfs/VipMasterIC/IC/SEIE/SEIE-S-A0009541969/SEIE-S-A0009541969-1.pdf?src-supplier=IHS+Markit; ComponentLink1Description: https://datasheet.ciiva.com:443/pdfs/VipMasterIC/IC/SEIE/SEIE-S-A0009541969/SEIE-S-A0009541969-1.pdf?src-supplier=IHS+Markit; ComponentLink2URL: https://datasheet.ciiva.com/3882/40960751s7172021n1174-3882844.pdf?src-supplier=Arrow+Electronics; ComponentLink2Description: https://datasheet.ciiva.com/3882/40960751s7172021n1174-3882844.pdf?src-supplier=Arrow+Electronics; ComponentLink3URL: https://datasheet.ciiva.com/15193/getdatasheetpartid-565526-15193591.pdf?src-supplier=Verical; ComponentLink3Description: https://datasheet.ciiva.com/15193/getdatasheetpartid-565526-15193591.pdf?src-supplier=Verical
R21 = RES 1M 0.1% 0.26W 0805: Fixed Resistor, Thin Film, 0.125W, 1000000ohm, 150V, 0.1% +/-Tol, 10ppm/Cel, Surface Mount, 0805; Manufacturer: Vishay Dale; Manufacturer Part Number: TNPW08051M00BYEA; Power: 125mW; Rated Temperature: 70°C; Value: 1MR; Temperature Coefficient (ppm/Cel): 10; Package Height: 0.45mm; Package Length: 2mm; Package Width: 1.25mm; Reference Standard: AEC-Q200; Supplier: Digikey; Supplier Part Number: 541-TNPW08051M00BYEACT-ND; RoHS: Yes; Category: Chip SMD Resistors; Stock: 10004; Pricing: 1=0.8, 10=0.665, 50=0.5832, 100=0.552, 500=0.41224, 1000=0.37822 (USD); Mounting Technology: Surface Mount; Pins: 2; Case/Package: 0805; Terminal Finish: Nickel; Min Operating Temperature: -55°C; Max Operating Temperature: 125°C; Tolerance: 0.1%; Resistor Type: FIXED RESISTOR; Construction: Chip; Packaging: Tape and Reel; Technology: THIN FILM; Termination: Wraparound; Working Voltage: 150V; Reach SVHC Compliant: Yes; RoHS Compliant: Yes; ComponentLink1URL: https://datasheet.ciiva.com:443/pdfs/VipMasterIC/IC/VISH/VISH-S-A0009889625/VISH-S-A0009889625-1.pdf?src-supplier=IHS+Markit; ComponentLink1Description: https://datasheet.ciiva.com:443/pdfs/VipMasterIC/IC/VISH/VISH-S-A0009889625/VISH-S-A0009889625-1.pdf?src-supplier=IHS+Markit; ComponentLink2URL: http://www.vishay.com/docs/28758/tnpw_e3.pdf?src-supplier=Digikey; ComponentLink2Description: http://www.vishay.com/docs/28758/tnpw_e3.pdf?src-supplier=Digikey; ComponentLink3URL: http://www.vishay.com/docs/28758/tnpw_e3.pdf?src-supplier=Avnet; ComponentLink3Description: http://www.vishay.com/docs/28758/tnpw_e3.pdf?src-supplier=Avnet
U2 = PfetSTS5P3LLH6: Power Field-Effect Transistor, 5A I(D), 1-Element, P-Channel, Metal-oxide Semiconductor FET; Manufacturer: STMicroelectronics; Power Dissipation-Max (Abs): 2.7W; Supplier: Arrow Electronics; Supplier Part Number: STS5P3LLH6; Manufacturer Part Number: STS5P3LLH6; RoHS: Yes; Category: MOSFETs; Stock: 10000; Pricing: 2500=0.2573 (USD); Max Operating Temperature: 150°C; Polarity/Channel Type: P-CHANNEL; Drain Current-Max (Abs) (ID): 5A; FET Technology: METAL-OXIDE SEMICONDUCTOR; Surface Mount: Yes; Reach SVHC Compliant: Yes; RoHS Compliant: Yes; ComponentLink1URL: https://datasheet.ciiva.com:443/pdfs/VipMasterIC/IC/SGST/SGST-S-A0000954121/SGST-S-A0000954121-1.pdf?src-supplier=IHS+Markit; ComponentLink1Description: https://datasheet.ciiva.com:443/pdfs/VipMasterIC/IC/SGST/SGST-S-A0000954121/SGST-S-A0000954121-1.pdf?src-supplier=IHS+Markit; ComponentLink2URL: http://www.mouser.com/ds/2/389/sts5p3llh6-956744.pdf?src-supplier=Mouser; ComponentLink2Description: http://www.mouser.com/ds/2/389/sts5p3llh6-956744.pdf?src-supplier=Mouser; ComponentLink3URL: http://www.st.com/content/ccc/resource/technical/document/datasheet/94/9d/bf/38/c5/95/4f/03/DM00084057.pdf/files/DM00084057.pdf/jcr:content/translations/en.DM00084057.pdf?src-supplier=Digikey; ComponentLink3Description: http://www.st.com/content/ccc/resource/technical/document/datasheet/94/9d/bf/38/c5/95/4f/03/DM00084057.pdf/files/DM00084057.pdf/jcr:content/translations/en.DM00084057.pdf?src-supplier=Digikey; ComponentLink4URL: https://datasheet.octopart.com/STS5P3LLH6-STMicroelectronics-datasheet-62337213.pdf?src-supplier=TME; ComponentLink4Description: https://datasheet.octopart.com/STS5P3LLH6-STMicroelectronics-datasheet-62337213.pdf?src-supplier=TME
U3 = IC BUCK LM25085MYX/NOPB: Switching Controller, Voltage-mode, 10A, 1000kHz Switching Freq-Max, PDSO8; Manufacturer: TI National Semiconductor; Package Body Material: Plastic; Max Supply Voltage: 42V; Min Input Voltage: 4.5V; Nominal Supply Voltage: 24V; Channels: 1; Package Equivalence Code: TSSOP8,.19; Frequency: 1MHz; Qualification Status: Not Qualified; Supplier: Digikey; Supplier Part Number: 296-LM25085MYX/NOPBCT-ND; Manufacturer Part Number: LM25085MYX/NOPB; RoHS: Yes; Category: Voltage Regulators - Switching; Stock: 7032; Pricing: 1=1.86, 10=1.37, 25=1.2468, 100=1.1115, 250=1.04696, 500=1.00806, 1000=0.97604 (USD); Case/Package: HTSSOP; Pins: 8; Package Shape: Square; Terminal Finish: Tin; Min Operating Temperature: -40°C; Max Operating Temperature: 125°C; JESD-609 Code: e3; Throw Configuration: SWITCHING CONTROLLER; Control Mode: VOLTAGE-MODE; JESD-30 Code: S-PDSO-G8; Moisture Sensitivity Level: 1; Package Style: SMALL OUTLINE, HEAT SINK/SLUG, THIN PROFILE, SHRINK PITCHMeter; Peak Reflow Temperature (Cel): 260°C; Surface Mount: Yes; Switcher Configuration: BUCK; Terminal Form: Gull Wing; Terminal Position: DUAL; Length: 3mm; Width: 3mm; Height - Seated (Max): 1.09mm; Terminal Pitch: 0.65mm; Temperature Grade: AUTOMOTIVE; Reach SVHC Compliant: Yes; RoHS Compliant: Yes; ComponentLink1URL: https://www.ti.com:443/lit/ds/symlink/lm25085-q1.pdf?src-supplier=IHS+Markit; ComponentLink1Description: https://www.ti.com:443/lit/ds/symlink/lm25085-q1.pdf?src-supplier=IHS+Markit; ComponentLink2URL: https://datasheet.ciiva.com/6594/lm25085-6594878.pdf?src-supplier=Digikey; ComponentLink2Description: https://datasheet.ciiva.com/6594/lm25085-6594878.pdf?src-supplier=Digikey
U4 = LDL1117S50R: Fixed Positive LDO Regulator, 5V, 0.6V Dropout, PDSO4; Manufacturer: STMicroelectronics; Package Body Material: Plastic; Dropout Voltage1-Max: 600mV; Max Supply Voltage: 18V; Min Input Voltage: 6V; Channels: 1; Output Current1-Max: 1.2A; Output Voltage1-Max: 5.15V; Output Voltage1-Min: 4.85V; Regulator Type: FIXED POSITIVE SINGLE OUTPUT LDO REGULATOR; Supplier: Arrow Electronics; Supplier Part Number: LDL1117S50R; Manufacturer Part Number: LDL1117S50R; RoHS: Yes; Category: Voltage Regulators - Linear; Stock: 195470; Pricing: 1=0.4496, 10=0.2819, 25=0.2795, 50=0.2738, 100=0.2253, 250=0.2208, 500=0.2045, 1000=0.1573 (USD); Case/Package: SOP; Pins: 4; Package Shape: Rectangular; JESD-30 Code: R-PDSO-G4; Operating Temperature, TJ-Max: 125°C; Operating Temperature, TJ-Min: -40°C; Output Voltage1-Nom: 5V; Package Style: SMALL OUTLINEMeter; Surface Mount: Yes; Terminal Form: Gull Wing; Terminal Position: DUAL; Length: 6.5mm; Width: 3.5mm; Height - Seated (Max): 1.9mm; Terminal Pitch: 2.3mm; Reach SVHC Compliant: Yes; RoHS Compliant: Yes; ComponentLink1URL: https://datasheet.ciiva.com:443/pdfs/VipMasterIC/IC/SGST/SGST-S-A0010030722/SGST-S-A0010030722-1.pdf?src-supplier=IHS+Markit; ComponentLink1Description: https://datasheet.ciiva.com:443/pdfs/VipMasterIC/IC/SGST/SGST-S-A0010030722/SGST-S-A0010030722-1.pdf?src-supplier=IHS+Markit; ComponentLink2URL: http://www.farnell.com/datasheets/2259188.pdf?src-supplier=Farnell; ComponentLink2Description: http://www.farnell.com/datasheets/2259188.pdf?src-supplier=Farnell; ComponentLink3URL: http://www.st.com/content/ccc/resource/technical/document/datasheet/group3/0e/5a/00/ca/10/1a/4f/a5/DM00366442/files/DM00366442.pdf/jcr:content/translations/en.DM00366442.pdf?src-supplier=Digikey; ComponentLink3Description: http://www.st.com/content/ccc/resource/technical/document/datasheet/group3/0e/5a/00/ca/10/1a/4f/a5/DM00366442/files/DM00366442.pdf/jcr:content/translations/en.DM00366442.pdf?src-supplier=Digikey; ComponentLink4URL: http://www.farnell.com/datasheets/2259188.pdf?src-supplier=Newark; ComponentLink4Description: http://www.farnell.com/datasheets/2259188.pdf?src-supplier=Newark
U5 = LDL1117S33R: Fixed Positive LDO Regulator, 3.3V, 0.6V Dropout, PDSO4; Manufacturer: STMicroelectronics; Package Body Material: Plastic; Channels: 1; Dropout Voltage1-Max: 600mV; Max Supply Voltage: 18V; Min Input Voltage: 4.3V; Output Current1-Max: 1.2A; Output Voltage1-Max: 3.399V; Output Voltage1-Min: 3.201V; Regulator Type: FIXED POSITIVE SINGLE OUTPUT LDO REGULATOR; Supplier 1: Arrow Electronics; Supplier Part Number 1: LDL1117S33R; Supplier: Arrow Electronics; Supplier Part Number: LDL1117S33R; Manufacturer Part Number: LDL1117S33R; RoHS: Yes; Category: Voltage Regulators - Linear; Stock: 650000; Pricing: 2500=0.294, 5000=0.2911, 7500=0.2135, 12500=0.1452, 17500=0.112, 25000=0.0997 (USD); Case/Package: SOP; Pins: 4; Package Shape: Rectangular; Package Style: SMALL OUTLINEMeter; Surface Mount: Yes; JESD-30 Code: R-PDSO-G4; Operating Temperature, TJ-Max: 125°C; Operating Temperature, TJ-Min: -40°C; Output Voltage1-Nom: 3.3V; Terminal Form: Gull Wing; Terminal Position: DUAL; Length: 6.5mm; Width: 3.5mm; Height - Seated (Max): 1.9mm; Terminal Pitch: 2.3mm; Reach SVHC Compliant: Yes; RoHS Compliant: Yes; ComponentLink1URL: https://datasheet.ciiva.com:443/pdfs/VipMasterIC/IC/SGST/SGST-S-A0010030722/SGST-S-A0010030722-1.pdf?src-supplier=IHS+Markit; ComponentLink1Description: https://datasheet.ciiva.com:443/pdfs/VipMasterIC/IC/SGST/SGST-S-A0010030722/SGST-S-A0010030722-1.pdf?src-supplier=IHS+Markit; ComponentLink2URL: http://www.farnell.com/datasheets/2259188.pdf?src-supplier=Farnell; ComponentLink2Description: http://www.farnell.com/datasheets/2259188.pdf?src-supplier=Farnell; ComponentLink3URL: http://www.st.com/content/ccc/resource/technical/document/datasheet/group3/0e/5a/00/ca/10/1a/4f/a5/DM00366442/files/DM00366442.pdf/jcr:content/translations/en.DM00366442.pdf?src-supplier=Digikey; ComponentLink3Description: http://www.st.com/content/ccc/resource/technical/document/datasheet/group3/0e/5a/00/ca/10/1a/4f/a5/DM00366442/files/DM00366442.pdf/jcr:content/translations/en.DM00366442.pdf?src-supplier=Digikey; ComponentLink4URL: http://www.farnell.com/datasheets/2259188.pdf?src-supplier=Element14; ComponentLink4Description: http://www.farnell.com/datasheets/2259188.pdf?src-supplier=Element14; ComponentLink5URL: http://www.farnell.com/datasheets/2259188.pdf?src-supplier=Newark; ComponentLink5Description: http://www.farnell.com/datasheets/2259188.pdf?src-supplier=Newark; ComponentLink6URL: https://datasheet.octopart.com/LDL1117S33R-STMicroelectronics-datasheet-165583407.pdf?src-supplier=TME; ComponentLink6Description: https://datasheet.octopart.com/LDL1117S33R-STMicroelectronics-datasheet-165583407.pdf?src-supplier=TME